# Altium schematic sheet Template.SchDoc
size A3; SheetNumber: 2; SheetTotal: 3
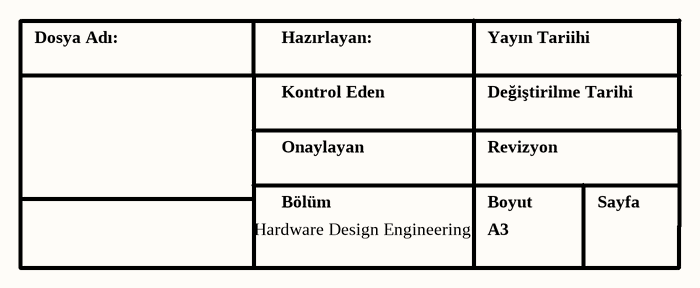
[diagram p0: Template.SchDoc]

## Notes on the sheet
- Dosya Adı:
- Hazırlayan:
- Yayın Tariihi
- Kontrol Eden
- Değiştirilme Tarihi
- Onaylayan
- Revizyon
- Hardware Design Engineering
- Bölüm
- Boyut
- A3
- Sayfa